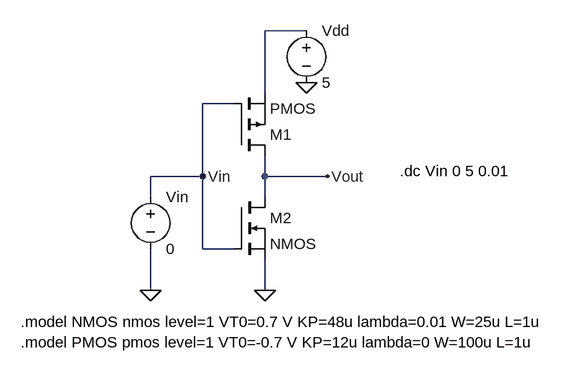
[diagram p0: schematic schema 1.2.asc]
schema 1.2.asc, the LTspice schematic file:
Version 4
SHEET 1 880 680
WIRE 320 -96 256 -96
WIRE 256 0 256 -96
WIRE 208 16 160 16
WIRE 160 128 160 16
WIRE 160 128 80 128
WIRE 256 128 256 96
WIRE 352 128 256 128
WIRE 80 160 80 128
WIRE 256 160 256 128
WIRE 160 240 160 128
WIRE 208 240 160 240
WIRE 80 304 80 240
WIRE 256 304 256 256
FLAG 352 128 Vout
FLAG 256 304 0
FLAG 320 -16 0
FLAG 80 304 0
FLAG 160 128 Vin
SYMBOL nmos 208 160 R0
SYMATTR InstName M2
SYMBOL voltage 320 -112 R0
SYMATTR InstName Vdd
SYMATTR Value 5
SYMBOL voltage 80 144 R0
SYMATTR InstName Vin
SYMATTR Value 0
SYMBOL pmos 208 96 M180
SYMATTR InstName M1
TEXT -120 352 Left 2 !.model NMOS nmos level=1 VT0=0.7 V KP=48u lambda=0.01 W=25u L=1u
TEXT -120 384 Left 2 !.model PMOS pmos level=1 VT0=-0.7 V KP=12u lambda=0 W=100u L=1u
TEXT 464 120 Left 2 !.dc Vin 0 5 0.01

The netlist it stands for:
* schema 1.2.asc
M2 Vout Vin 0 0 NMOS
Vdd N001 0 5
Vin Vin 0 0
M1 Vout Vin N001 N001 PMOS
.model NMOS NMOS
.model PMOS PMOS
.lib standard.mos
.model NMOS nmos level=1 VT0=0.7 V KP=48u lambda=0.01 W=25u L=1u
.model PMOS pmos level=1 VT0=-0.7 V KP=12u lambda=0 W=100u L=1u
.dc Vin 0 5 0.01
.backanno
.end

* Results of the author's LTspice run, read from the files saved beside the schematic
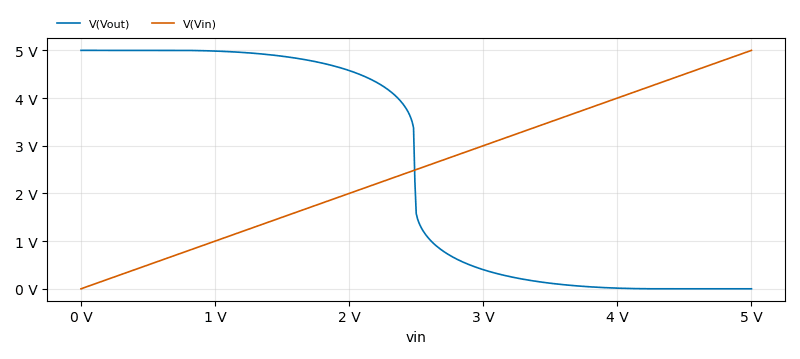
[diagram p1: DC transfer characteristic of schema 1.2.asc, plotted from the saved traces]
* DC transfer characteristic, 1 run:
*   V(Vout): 5 V at vin=0 V, 1.94 nV at vin=5 V, min 1.94 nV, max 5 V
*   V(Vin): 0 V at vin=0 V, 5 V at vin=5 V, min 0 V, max 5 V